# Altium schematic sheet Teensy4.1.SchDoc
size A4; SheetNumber: 8; SheetTotal: 10
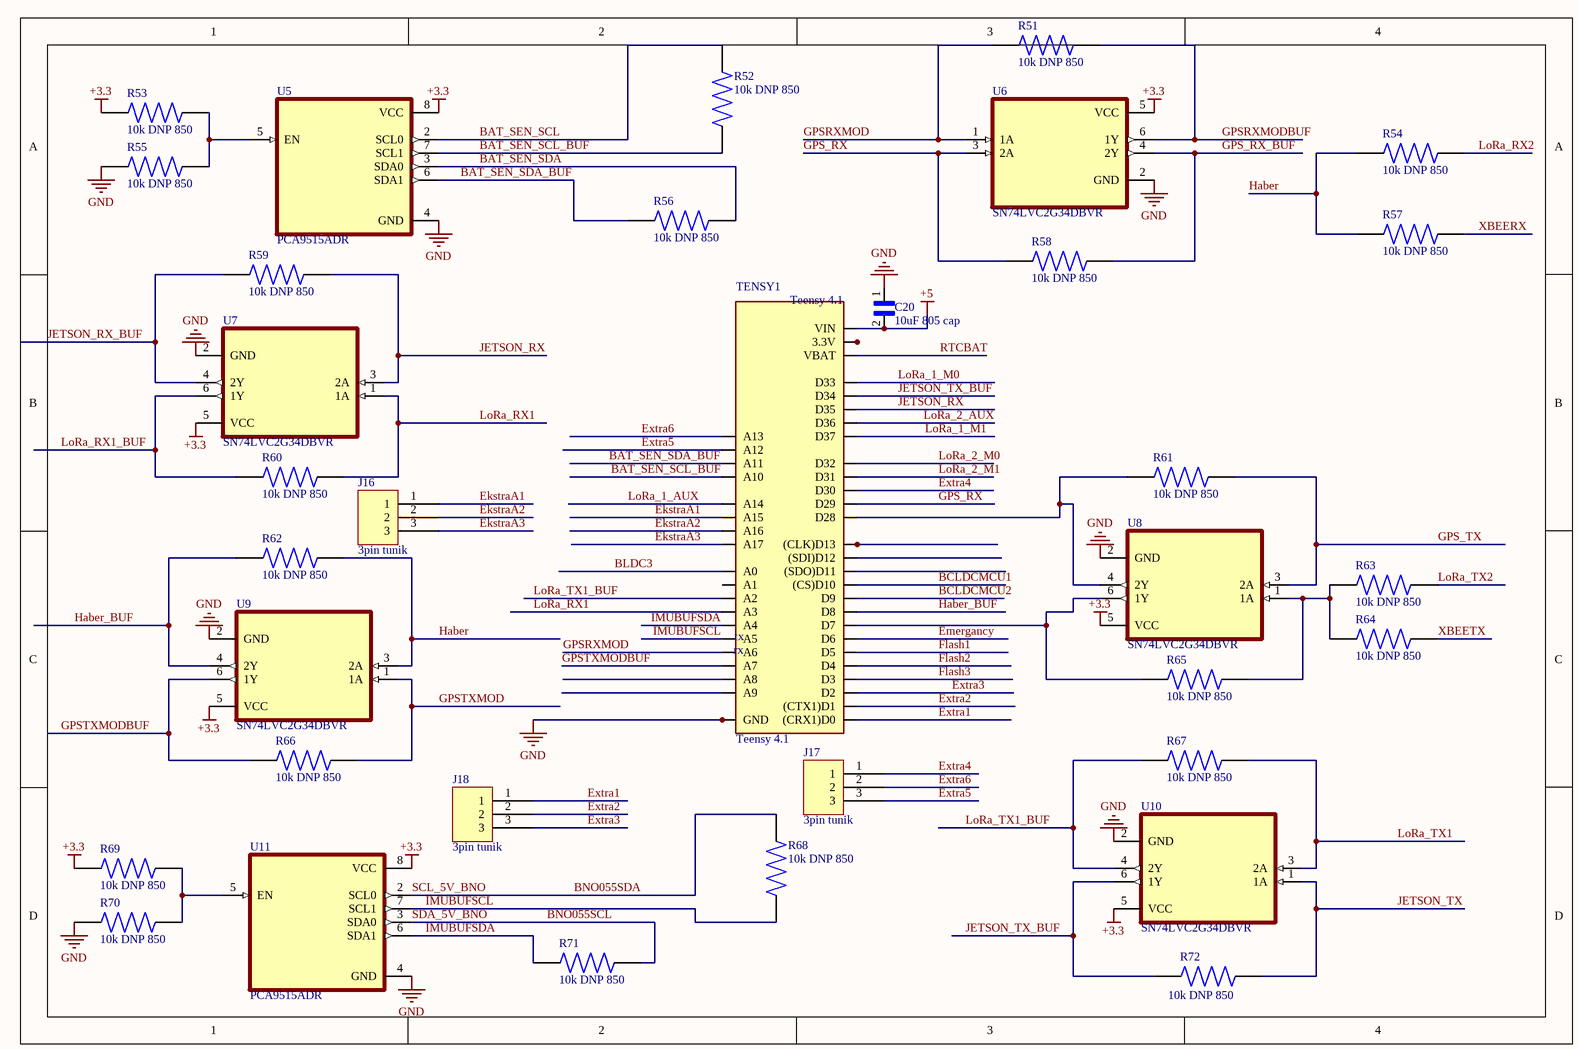
[diagram p0: Teensy4.1.SchDoc]

## Parts
C20  10uF 805 cap  [1uF 805 Cap]
J16  3pin tunik  [3pin tunik]
J17  3pin tunik  [3pin tunik]
J18  3pin tunik  [3pin tunik]
R51  10k DNP 850  [10k 850]
R52  10k DNP 850  [10k 850]
R53  10k DNP 850  [10k 850]
R54  10k DNP 850  [10k 850]
R55  10k DNP 850  [10k 850]
R56  10k DNP 850  [10k 850]
R57  10k DNP 850  [10k 850]
R58  10k DNP 850  [10k 850]
R59  10k DNP 850  [10k 850]
R60  10k DNP 850  [10k 850]
R61  10k DNP 850  [10k 850]
R62  10k DNP 850  [10k 850]
R63  10k DNP 850  [10k 850]
R64  10k DNP 850  [10k 850]
R65  10k DNP 850  [10k 850]
R66  10k DNP 850  [10k 850]
R67  10k DNP 850  [10k 850]
R68  10k DNP 850  [10k 850]
R69  10k DNP 850  [10k 850]
R70  10k DNP 850  [10k 850]
R71  10k DNP 850  [10k 850]
R72  10k DNP 850  [10k 850]
TENSY1  Teensy 4.1  [Teensy 4.1]
U5  PCA9515ADR  [SOIC127P599X175-8N]
U6  SN74LVC2G34DBVR  [SOT95P280X145-6N]
U7  SN74LVC2G34DBVR  [SOT95P280X145-6N]
U8  SN74LVC2G34DBVR  [SOT95P280X145-6N]
U9  SN74LVC2G34DBVR  [SOT95P280X145-6N]
U10  SN74LVC2G34DBVR  [SOT95P280X145-6N]
U11  PCA9515ADR  [SOIC127P599X175-8N]

## Nets
+3.3: R53.1 R69.1 U5.8(VCC) U6.5(VCC) U7.5(VCC) U8.5(VCC) U9.5(VCC) U10.5(VCC) U11.8(VCC)
+5: C20.2 TENSY1.VIN
GND: C20.1 R55.1 R70.1 TENSY1.AGND/GND(GND) TENSY1.GND TENSY1.GND@2(GND) U5.4(GND) U6.2(GND) U7.2(GND) U8.2(GND) U9.2(GND) U10.2(GND) U11.4(GND)
BAT_SEN_SCL: R52.1 U5.2(SCL0)
BAT_SEN_SCL_BUF: R52.2 TENSY1.D24(A10) U5.7(SCL1)
BAT_SEN_SDA: R56.2 U5.3(SDA0)
BAT_SEN_SDA_BUF: R56.1 TENSY1.D25(A11) U5.6(SDA1)
BCLDCMCU1: TENSY1.D10((CS)D10)
BCLDCMCU2: TENSY1.D9
BLDC3: TENSY1.D14(A0)
BNO055SCL: R71.2 U11.3(SDA0)  [also labelled SDA_5V_BNO]
BNO055SDA: R68.1 U11.2(SCL0)  [also labelled SCL_5V_BNO]
EkstraA1: J16.1 TENSY1.D39(A15)
EkstraA2: J16.2 TENSY1.D40(A16)
EkstraA3: J16.3 TENSY1.D41(A17)
Emergancy: TENSY1.D6
Extra1: J18.1 TENSY1.D0((CRX1)D0)
Extra2: J18.2 TENSY1.D1((CTX1)D1)
Extra3: J18.3 TENSY1.D2
Extra4: J17.1 TENSY1.D30
Extra5: J17.3 TENSY1.D26(A12)
Extra6: J17.2 TENSY1.D27(A13)
Flash1: TENSY1.D5
Flash2: TENSY1.D4
Flash3: TENSY1.D3
GPS_RX: R58.1 TENSY1.D29 U6.3(2A)
GPS_RX_BUF: R58.2 U6.4(2Y)
GPS_TX: R61.2 U8.3(2A)
GPSRXMOD: R51.1 TENSY1.D20(A6) U6.1(1A)
GPSRXMODBUF: R51.2 U6.6(1Y)
GPSTXMOD: R66.2 U9.1(1A)
GPSTXMODBUF: R66.1 TENSY1.D21(A7) U9.6(1Y)
Haber: R54.1 R57.1 R62.2 U9.3(2A)
Haber_BUF: R62.1 TENSY1.D8 U9.4(2Y)
IMUBUFSCL: R68.2 TENSY1.D19(A5) U11.7(SCL1)
IMUBUFSDA: R71.1 TENSY1.D18(A4) U11.6(SDA1)
JETSON_RX: R59.2 TENSY1.D35 U7.3(2A)
JETSON_RX_BUF: R59.1 U7.4(2Y)
JETSON_TX: R72.2 U10.1(1A)
JETSON_TX_BUF: R72.1 TENSY1.D34 U10.6(1Y)
LoRa_1_AUX: TENSY1.D38(A14)
LoRa_1_M0: TENSY1.D33
LoRa_1_M1: TENSY1.D37
LoRa_2_AUX: TENSY1.D36
LoRa_2_M0: TENSY1.D32
LoRa_2_M1: TENSY1.D31
LoRa_RX1: R60.2 TENSY1.D17(A3) U7.1(1A)
LoRa_RX1_BUF: R60.1 U7.6(1Y)
LoRa_RX2: R54.2
LoRa_TX1: R67.2 U10.3(2A)
LoRa_TX1_BUF: R67.1 TENSY1.D16(A2) U10.4(2Y)
LoRa_TX2: R63.2
RTCBAT: TENSY1.VBAT
XBEERX: R57.2
XBEETX: R64.2
NetR53_2: R53.2 R55.2 U5.5(EN)
NetR61_1: R61.1 TENSY1.D28 U8.4(2Y)
NetR63_1: R63.1 R64.1 R65.2 U8.1(1A)
NetR65_1: R65.1 TENSY1.D7 U8.6(1Y)
NetR69_2: R69.2 R70.2 U11.5(EN)
NetTENSY1_3V3: TENSY1.3V3(3.3V) TENSY1.3V3@2(3.3V) TENSY1.3V3@3(3.3V)

Not connected (* = marked no-connect by the designer): TENSY1 D11((SDO)D11) D12((SDI)D12) D13((CLK)D13) D15(A1) D22(A8) D23(A9)

## Notes on the sheet
- (near TENSY1) rx
- (near TENSY1) tx

## Library data of the parts
C20 = 1uF 805 cap
R51-R72 = 10k 850
U5 U11 = PCA9515ADR: Dual Bidirectional I2C Bus and SMBus Repeater 8-SOIC -40 to 85; MF: Texas Instruments; SnapEDA_Link: https://www.snapeda.com/parts/PCA9515ADR/Texas+Instruments/view-part/?ref=snap; Package: SOIC-8 Texas Instruments; Value: *; MP: PCA9515ADR; Check_prices: https://www.snapeda.com/parts/PCA9515ADR/Texas+Instruments/view-part/?ref=eda
U6-U10 = SN74LVC2G34DBVR: 2-ch, 1.65-V to 5.5-V buffers; MF: Texas Instruments; SnapEDA_Link: https://www.snapeda.com/parts/SN74LVC2G34DBVR/Texas+Instruments/view-part/?ref=snap; Package: SOT-23-6 Texas Instruments; Value: *; MP: SN74LVC2G34DBVR; Check_prices: https://www.snapeda.com/parts/SN74LVC2G34DBVR/Texas+Instruments/view-part/?ref=eda